# Altium schematic sheet obc-v2_CM4-SPI-UART.SchDoc
size 420 x 297 mm; SheetNumber: 15; SheetTotal: 21
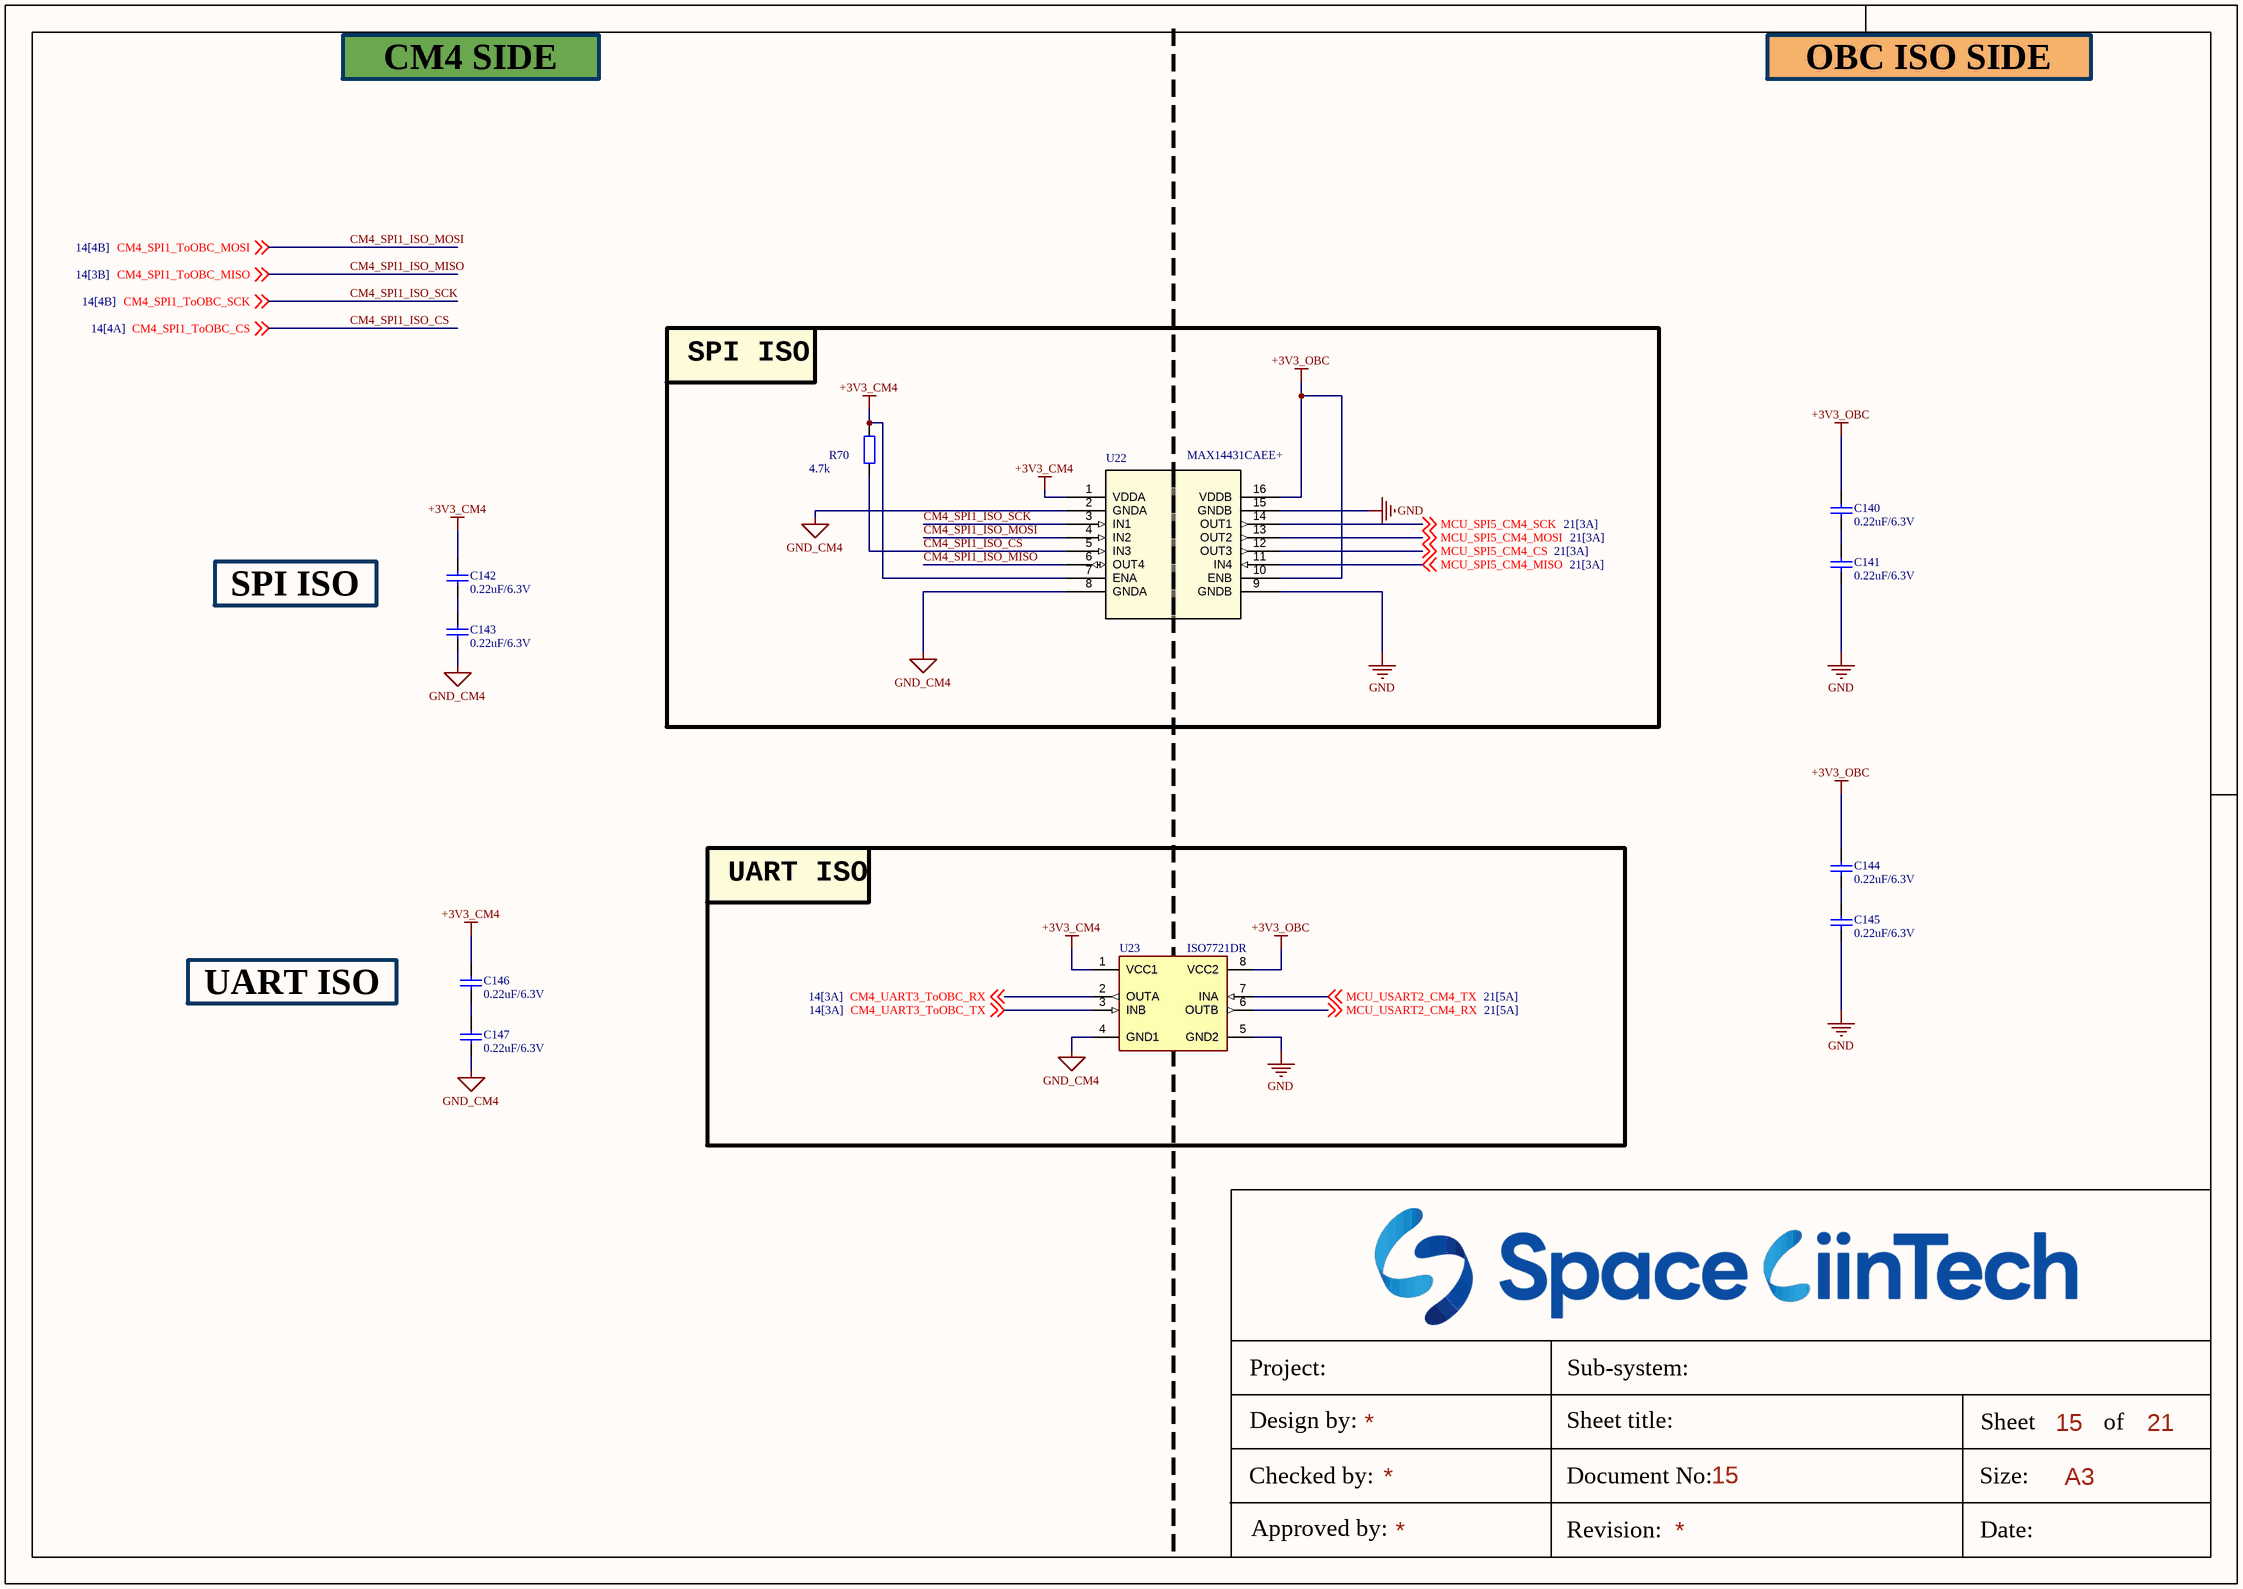
[diagram p0: obc-v2_CM4-SPI-UART.SchDoc]

## Parts
C140  0.22uF/6.3V  [CAP_C_1005X60]
C141  0.22uF/6.3V  [CAP_C_1005X60]
C142  0.22uF/6.3V  [CAP_C_1005X60]
C143  0.22uF/6.3V  [CAP_C_1005X60]
C144  0.22uF/6.3V  [CAP_C_1005X60]
C145  0.22uF/6.3V  [CAP_C_1005X60]
C146  0.22uF/6.3V  [CAP_C_1005X60]
C147  0.22uF/6.3V  [CAP_C_1005X60]
R70  4.7k  [RES_C_1608X60]
U22  MAX14431CAEE+  [21-0055Q_E16MS+1F_MXM]
U23  ISO7721DR  [SOIC127P602X173-8N]

## Blocks framed on the sheet
SPI ISO: R70 U22
UART ISO: U23

## Nets
+3V3_CM4: C142.1 C146.1 R70.2 U22.1(VDDA) U22.7(ENA) U23.1(VCC1)
+3V3_OBC: C140.2 C144.2 U22.10(ENB) U22.16(VDDB) U23.8(VCC2)
GND: C141.1 C145.1 U22.9(GNDB) U22.15(GNDB) U23.5(GND2)
GND_CM4: C143.2 C147.2 U22.2(GNDA) U22.8(GNDA) U23.4(GND1)
CM4_SPI1_ISO_CS: R70.1 U22.5(IN3) ; off-sheet CM4_SPI1_ToOBC_CS  [also labelled CM4_SPI1_ToOBC_CS]
CM4_SPI1_ISO_MISO: U22.6(OUT4) ; off-sheet CM4_SPI1_ToOBC_MISO  [also labelled CM4_SPI1_ToOBC_MISO]
CM4_SPI1_ISO_MOSI: U22.4(IN2) ; off-sheet CM4_SPI1_ToOBC_MOSI  [also labelled CM4_SPI1_ToOBC_MOSI]
CM4_SPI1_ISO_SCK: U22.3(IN1) ; off-sheet CM4_SPI1_ToOBC_SCK  [also labelled CM4_SPI1_ToOBC_SCK]
CM4_UART3_ToOBC_RX: U23.2(OUTA) ; off-sheet CM4_UART3_ToOBC_RX
CM4_UART3_ToOBC_TX: U23.3(INB) ; off-sheet CM4_UART3_ToOBC_TX
MCU_SPI5_CM4_CS: U22.12(OUT3) ; off-sheet MCU_SPI5_CM4_CS
MCU_SPI5_CM4_MISO: U22.11(IN4) ; off-sheet MCU_SPI5_CM4_MISO
MCU_SPI5_CM4_MOSI: U22.13(OUT2) ; off-sheet MCU_SPI5_CM4_MOSI
MCU_SPI5_CM4_SCK: U22.14(OUT1) ; off-sheet MCU_SPI5_CM4_SCK
MCU_USART2_CM4_RX: U23.6(OUTB) ; off-sheet MCU_USART2_CM4_RX
MCU_USART2_CM4_TX: U23.7(INA) ; off-sheet MCU_USART2_CM4_TX
NetC140_1: C140.1 C141.2
NetC142_2: C142.2 C143.1
NetC144_1: C144.1 C145.2
NetC146_2: C146.2 C147.1

## Notes on the sheet
- CM4 SIDE
- OBC ISO SIDE
- SPI ISO
- UART ISO
- Project:
- Sub-system:
- Design by:
- Sheet title:
- Sheet
- A3
- of
- Checked by:
- Approved by:
- Revision:
- Document No:
- Size:
- Date:

## Library data of the parts
C140-C147 = Tu 0402 33nF 10V: CAPC; Chung_Loai: Dán; Don_Vi: Con; So_Chan: 2; Ten_Linh_Kien: Tụ 0402 33nF X7R 10V GRM155R71A333KA01D; Ma_Hang: MH007853; Kieu_Chan: *
R70 = Tro 0603 1% 10k: RES; Chung_Loai: Dán; Don_Vi: Con; So_Chan: 2; Ten_Linh_Kien: Trở 0603 1% 10k; Ma_Hang: MH006333; Kieu_Chan: *
U22 = MAX14431CAEE+: No Description Available; Mfr_Name: Analog Devices / Maxim Integrated; RefDes: RefDes; Type: Type
U23 = ISO7721DR: Robust EMC, dual-channel, 1/1, reinforced digital isolator 8-SOIC -55 to 125; Package: None; Value: *; MP: ISO7721DR; Availability: Unavailable; Price: None